# EAGLE schematic Ex EEPROM (EAGLE 7.5.0)
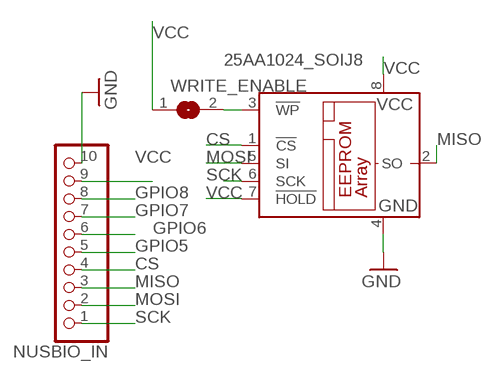
[diagram p0: schematic, sheet 1]

## Parts
25AA1024_SOIJ8  25AA080SN  [SO-08]
NUSBIO_IN  PINHD-1X10  [1X10-BIG]
WRITE_ENABLE  SOLDERJUMPERREFLOW  [SOLDERJUMPER_REFLOW]

## Nets
CS: 25AA1024_SOIJ8.1(!CS) NUSBIO_IN.4
GND: 25AA1024_SOIJ8.4(GND) NUSBIO_IN.10
GPIO5: NUSBIO_IN.5
GPIO6: NUSBIO_IN.6
GPIO7: NUSBIO_IN.7
GPIO8: NUSBIO_IN.8
MISO: 25AA1024_SOIJ8.2(SO) NUSBIO_IN.3
MOSI: 25AA1024_SOIJ8.5(SI) NUSBIO_IN.2
N$1: 25AA1024_SOIJ8.3(!WP) WRITE_ENABLE.2
SCK: 25AA1024_SOIJ8.6(SCK) NUSBIO_IN.1
VCC: 25AA1024_SOIJ8.7(!HOLD) 25AA1024_SOIJ8.8(VCC) NUSBIO_IN.9 WRITE_ENABLE.1

## Library data of the parts
25AA1024_SOIJ8 = microchip:25*: Serial EEPROM 4K/ 8K , SPI bus; MF: MICROCHIP; MPN: 25AA080/SN; OC_FARNELL: 1816072; OC_NEWARK: 92C7351
NUSBIO_IN = adafruit:PINHD-1X10: Pin header 1x10 0.1" spacing With round pins
WRITE_ENABLE = microbuilder:SOLDERJUMPER: SMD Solder JUMPER Solder the two pads together to create a connection, or remove the solder to break it. REFLOW - Use this footprint for solder paste and reflow ovens. WAVE - Use this footprint for hand-soldering (larger pads). CLOSED - Has a trace between the two pads to ensure it is closed by default. The trace needs to be cut to disable the jumper, and can be closed again by creating a solder bridge between the two pads.